# Altium project ADC_Project.PrjPcb
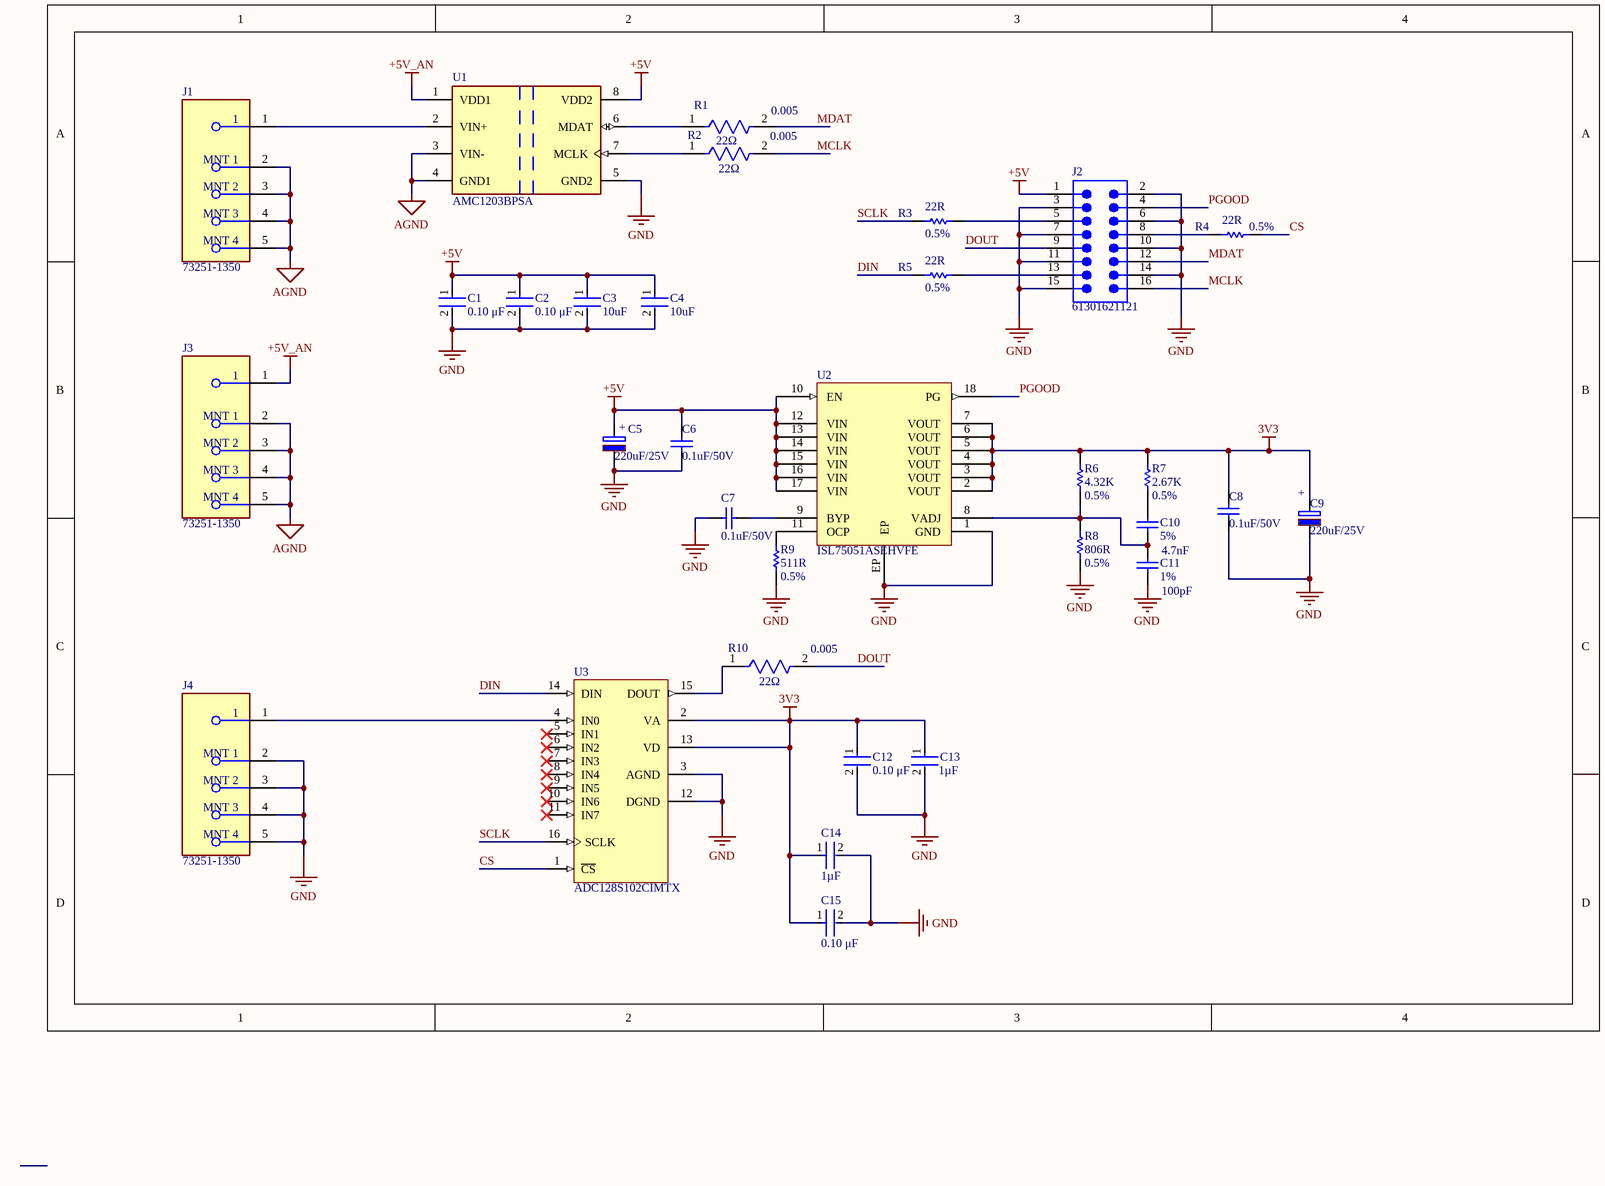
[diagram p0: 1_Schematic.SchDoc]
1 sheet, 32 parts. Net scope: global (net labels, ports and power ports of the same name join across sheets).
Board file: ADC_PCB.PcbDoc

## Sheet 1_Schematic.SchDoc
size A4; SheetNumber: 1; SheetTotal: 1

### Parts
C1  Capacitance: 0.10 μF  [FP-C0603C-CF-MFG]  (hidden comment: C0603C104J5RACTU)
C2  Capacitance: 0.10 μF  [FP-C0603C-CF-MFG]  (hidden comment: C0603C104J5RACTU)
C3  value 10uF  [FP-GRM188-0_2-IPC_A]  (hidden comment: GRM188R61E106KA73D)
C4  value 10uF  [FP-GRM188-0_2-IPC_A]  (hidden comment: GRM188R61E106KA73D)
C5  220uF/25V  [CAP_AE830X1050N]
C6  0.1uF/50V  [CAPC1608X90N]
C7  0.1uF/50V  [CAPC1608X90N]
C8  0.1uF/50V  [CAPC1608X90N]
C9  220uF/25V  [CAP_AE830X1050N]
C10  4.7nF  Tolerance: 5%  [CAPC1608X90N]
C11  100pF  Tolerance: 1%  [CAPC1608X90N]
C12  Capacitance: 0.10 μF  [FP-C0603C-CF-MFG]  (hidden comment: C0603C104J5RACTU)
C13  Capacitance: 1µF  [FP-GCM188-0_1-MFG]  (hidden comment: GCM188R71E105KA64D)
C14  Capacitance: 1µF  [FP-GCM188-0_1-MFG]  (hidden comment: GCM188R71E105KA64D)
C15  Capacitance: 0.10 μF  [FP-C0603C-CF-MFG]  (hidden comment: C0603C104J5RACTU)
J1  73251-1350  [FP-73251-1350-MFG]
J2  61301621121  [61301621121]
J3  73251-1350  [FP-73251-1350-MFG]
J4  73251-1350  [FP-73251-1350-MFG]
R1  value 22Ω  Tolerance: 0.005  [FP-RT0603-MFG]  (hidden comment: RT0603DRD0722RL)
R2  value 22Ω  Tolerance: 0.005  [FP-RT0603-MFG]  (hidden comment: RT0603DRD0722RL)
R3  22R  Tolerance: 0.5%  [RESC1608X55N]
R4  22R  Tolerance: 0.5%  [RESC1608X55N]
R5  22R  Tolerance: 0.5%  [RESC1608X55N]
R6  4.32K  Tolerance: 0.5%  [RESC1608X55N]
R7  2.67K  Tolerance: 0.5%  [RESC1608X55N]
R8  806R  Tolerance: 0.5%  [RESC1608X55N]
R9  511R  Tolerance: 0.5%  [RESC1608X55N]
R10  value 22Ω  Tolerance: 0.005  [FP-RT0603-MFG]  (hidden comment: RT0603DRD0722RL)
U1  AMC1203BPSA  [FP-PSA0008A-IPC_C]
U2  ISL75051ASEHVFE  [CFP102P1520X310-18AN]
U3  ADC128S102CIMTX  [MTC16_N]

### Nets
3V3: C8.1 C9.1 C12.1 C13.1 C14.1 C15.1 R6.2 R7.2 U2.2(VOUT) U2.3(VOUT) U2.4(VOUT) U2.5(VOUT) U2.6(VOUT) U2.7(VOUT) U3.2(VA) U3.13(VD)
+5V: C1.1 C2.1 C3.1 C4.1 C5.1 C6.1 J2.1 U1.8(VDD2) U2.10(EN) U2.12(VIN) U2.13(VIN) U2.14(VIN) U2.15(VIN) U2.16(VIN) U2.17(VIN)
+5V_AN: J3.1 U1.1(VDD1)
AGND: J1.2(MNT_1) J1.3(MNT_2) J1.4(MNT_3) J1.5(MNT_4) J3.2(MNT_1) J3.3(MNT_2) J3.4(MNT_3) J3.5(MNT_4) U1.3(VIN-) U1.4(GND1)
GND: C1.2 C2.2 C3.2 C4.2 C5.2 C6.2 C7.2 C8.2 C9.2 C11.2 C12.2 C13.2 C14.2 C15.2 J2.2 J2.3 J2.6 J2.7 J2.10 J2.11 J2.14 J2.15 J4.2(MNT_1) J4.3(MNT_2) J4.4(MNT_3) J4.5(MNT_4) R8.1 R9.1 U1.5(GND2) U2.1(GND) U2.EP U3.3(AGND) U3.12(DGND)
CS: R4.2 U3.1(~{CS})
DIN: R5.1 U3.14(DIN)
DOUT: J2.9 R10.2
MCLK: J2.16 R2.2
MDAT: J2.12 R1.2
PGOOD: J2.4 U2.18(PG)
SCLK: R3.1 U3.16(SCLK)
NetC7_1: C7.1 U2.9(BYP)
NetC10_1: C10.1 R7.1
NetC10_2: C10.2 C11.1 R6.1 R8.2 U2.8(VADJ)
NetJ1_1: J1.1 U1.2(VIN+)
NetJ2_5: J2.5 R3.2
NetJ2_8: J2.8 R4.1
NetJ2_13: J2.13 R5.2
NetJ4_1: J4.1 U3.4(IN0)
NetR1_1: R1.1 U1.6(MDAT)
NetR2_1: R2.1 U1.7(MCLK)
NetR9_2: R9.2 U2.11(OCP)
NetR10_1: R10.1 U3.15(DOUT)

Not connected (* = marked no-connect by the designer): U3 5(IN1)* 6(IN2)* 7(IN3)* 8(IN4)* 9(IN5)* 10(IN6)* 11(IN7)*

### Notes on the sheet
- (in symbol CAP ALUM 220UF 20% 25V SMD) +

### Library data of the parts
C1 C2 C12 C15 = CMP-2006-03056-2: CAP CER 0.1UF 50V 5% X7R 0603; Manufacturer: KEMET; Automotive Grade: Grade 1; Tolerance: 0.05; Value: 0.10 μF; Material: Ceramic; Temperature Coefficient: 30ppm/°C; ComponentLink2Description: Datasheet; Voltage Rating: 50 V; Digikey Description: CAP CER 0.1UF 50V 5% X7R 0603; Manufacturer Part Number: C0603C104J5RACTU; Temperature Range High: +125°C; Device Class L2: Capacitors; Octopart: https://octopart.com/c0603c104j5ractu-kemet-10440638; RoHS: TRUE; Mouser Description: Multilayer Ceramic Capacitors MLCC - SMD/SMT 50volts 0.1uF X7R 5%; Temperature Range Low: -55°C; Automotive: Yes; Lead Free: Yes; ComponentLink2URL: https://api.kemet.com/component-edge/download/datasheet/C0603C100J5GACAUTO.pdf; Device Class L3: Ceramic Capacitors; Package: C0603C-CF; Category: Cap; Temperature: -55°C to +125°C; Height: 0.87mm; Temperature Characteristic: X7R; Device Class L1: Passive Components
C3 C4 = CMP-06035-045268-1: Chip Multilayer Ceramic Capacitors for General Purpose, 0603, 10uF, X5R, 15%, 10%, 25V; Case/Package: 0603
C5 C9 = CAP ALUM 220UF 20% 25V SMD: Manufacturer Part Number: EMZA250ADA221MHA0G; Manufacturer: United Chemi-Con; value: 220uF/25V; Height: 10.5mm; ComponentLink1Description: New link; ComponentLink1URL: *; Tolerance: ±20%; Supplier Part Number 1: 565-2550-1-ND
  C5: Supplier 1: DigiKey; Supplier 2: Mouser; Supplier Part Number 2: 667-EEE-FK1E221P
  C9: Supplier 1: Digi-Key
C6-C8 = CAP CER 0.1UF 50V X7R 0603: Manufacturer Part Number: CL10B104KB8NNNC; Manufacturer: Samsung Electro-Mechanics; Tolerance: ±10%; Supplier Part Number 1: 1276-1000-1-ND; Package: 0603; value: 0.1uF/50V; Supplier 1: Digi-Key; Height: 0.9mm; ComponentLink1Description: New link; ComponentLink1URL: *; Voltage - Rated: 50V
C10 = CAP CER 4700PF 50V C0G 0603: Manufacturer Part Number: CGA3E2C0G1H472J080AA; Manufacturer: TDK Corporation; Supplier Part Number 1: 445-6912-1-ND; Package: 0603; value: 4.7nF; Supplier 1: Digi-Key; Height: 0.9mm; ComponentLink1Description: New link; ComponentLink1URL: *; Voltage - Rated: 50V
C11 = CAP CER 100PF 50V C0G/NP0 0603: Manufacturer Part Number: 06035A101FAT2A; Manufacturer: KYOCERA AVX; Supplier Part Number 1: 478-6202-1-ND; Package: 0603; value: 100pF; Supplier 1: Digi-Key; Height: 0.9mm; ComponentLink1Description: New link; ComponentLink1URL: *; Voltage - Rated: 50V
C13 C14 = CMP-2006-02363-4: Manufacturer Lifecycle Status: IN PRODUCTION; NexarPartId: 18909256; Dielectric: X7R; Material: Ceramic; Tolerance: 10%; Voltage Rating: 25V; Thickness: 889µm; Max Operating Temperature: 125°C; Radiation Hardening: No; Weight: 6.293594mg; Lead Free: Lead Free; Mount: Surface Mount; Case Code (Imperial): 0603; REACH SVHC: No SVHC; Lifecycle Status: Production; Depth: 800µm; Min Operating Temperature: -55°C; Height: 800µm; Case Code (Metric): 1608; Case/Package: 0603; Voltage: 25V; Packaging: Cut Tape; Length: 1.6mm; Termination: SMD/SMT; Width: 787.4µm; Voltage Rating (DC): 25V; RoHS: Compliant; Schedule B: 8532240020, 8532240020; Ratings: AEC-Q200
J1 J3 J4 = CMP-04764-000006-1: CONN SMA JACK STR 50 OHM SMD; Manufacturer: Molex; Is Female: yes; Standoff Height: 0.41mm; Impedance: 50Ω; Number Of Contacts: 1; Conn Orientation: Straight; Voltage Rating: 500V; Shielding: true; Frequency: 18GHz; Package: 73251-1350; Device Class L1: Connectors; Category: Conn; Manufacturer Part Number: 73251-1350; ComponentLink2URL: https://www.molex.com/pdm_docs/sd/732511350_sd.pdf; Automotive: No; Height: 9.655mm; Octopart: https://octopart.com/73251-1350-molex-5414390; Footprint Url: https://forum.upverter.com/uploads/default/original/3X/d/a/daeafa2ce4908d4fc4e49f0b17d7d2c986fce444.pdf; Temperature Range High: +165°C; Device Class L3: unset; Mouser Description: RF Connectors / Coaxial Connectors SMA ST PCB-JCK STD SMT; Lead Free: Yes; Temperature: -65°C to +165°C; RoHS: TRUE; ComponentLink2Description: Datasheet; Device Class L2: RF / Coaxial Connectors; Digikey Description: CONN SMA JACK STR 50 OHM SMD; Contact Material: Gold; Temperature Range Low: -65°C
J2 = CMP-1502-01097-2: NexarPartId: 32855550; Gender: Male; Pitch: 2.54mm; Contact Resistance: 20mΩ; Connector Type: Male Pin; Voltage Rating: 250V; Number of Contacts: 16; Current Rating: 3A; Orientation: Vertical; Packaging: Bulk; Contact Plating: Gold; Max Operating Temperature: 105°C; Contact Mating Length: 5.9944mm; Termination: Solder; Row Spacing: 2.54mm; REACH SVHC: Unknown; Height: 8.89mm; RoHS: Compliant; Number of Pins: 16; Number of Rows: 2; Mount: Through Hole; Contact Material: Copper; Number of Positions: 16; Min Operating Temperature: -40°C; Operating Supply Voltage: 250V; Lead Pitch: 2.54mm; Color: Black
R1 R2 R10 = CMP-03412-013306-1: RES SMD 22 OHM 0.5% 1/10W 0603; Manufacturer: Yageo; Temperature Coefficient: 25 ppm/°C; Power Rating: 0.1W; Voltage Rating: 75V; Temperature: -55°C to +155°C; ComponentLink2URL: http://www.yageo.com/documents/recent/PYu-RT_1-to-0.01_RoHS_L_9.pdf; ComponentLink2Description: Datasheet; Package: RT0603; Automotive: No; Manufacturer Part Number: RT0603DRD0722RL; Category: Res; Temperature Range High: +155°C; Device Class L3: Chip SMD Resistors; Footprint Url: http://www.yageo.com/exep/pages/download/literatures/PYu-R_Mount_10.pdf; Device Class L1: Passive Components; Series: RT; Lead Free: Yes; Digikey Description: RES SMD 22 OHM 0.5% 1/10W 0603; Composition: Thin Film; Resistance: 22Ω; Ipc Land Pattern Name: RESC16080X45; Height: 0.55mm; Device Class L2: Resistors; RoHS: TRUE; Octopart: https://octopart.com/rt0603drd0722rl-yageo-1189544; Temperature Range Low: -55°C
R3-R5 = RES SMD 22 OHM 0.5% 1/10W 0603: Manufacturer: Yageo; Manufacturer Part Number: RT0603DRD0722RL; Supplier Part Number 1: 13-RT0603DRD0722RLCT-ND; Package: 0603; Height: 0.55mm; Supplier 1: Digi-Key; value: 22R
R6 = RES SMD 4.32K OHM 0.5% 1/5W 0603: Manufacturer: Panasonic Electronic Components; Manufacturer Part Number: ERJ-PB3D4321V; Supplier Part Number 1: P20355CT-ND; Package: 0603; Height: 0.55mm; Supplier 1: Digi-Key; value: 4.32K
R7 = RES SMD 2.67KOHM 0.5% 1/10W 0603: Manufacturer: Yageo; Manufacturer Part Number: RT0603DRD072K67L; Supplier Part Number 1: 311-2.67KDCT-ND; Package: 0603; Height: 0.55mm; Supplier 1: Digi-Key; value: 2.67K
R8 = RES SMD 806 OHM 0.5% 1/10W 0603: Manufacturer: Yageo; Manufacturer Part Number: RT0603DRD0762KL; Supplier Part Number 1: 311-806DCT-ND; Package: 0603; Height: 0.55mm; Supplier 1: Digi-Key; value: 806R
R9 = RES SMD 511 OHM 1% 1/10W 0603: Manufacturer: Panasonic Electronic Components; Manufacturer Part Number: ERJ-3EKF5110V; Supplier Part Number 1: P511HCT-ND; Package: 0603; Height: 0.55mm; Supplier 1: Digi-Key; value: 511R
U1 = CMP-04860-000036-1: IC ADC 16BIT SIGMA-DELTA 8SOP; Input Type: DIFFERENTIAL; Min Supply Voltage: 4.5V; Max Power Dissipation: 110mW; Supply Type: Analog; Operating Supply Voltage: 5V; Number of Channels: 1; Number of Bits: 16; Power Consumption: 80mW; Interface: Serial; Differential Nonlinearity: 1LSB; Signal to Noise Ratio (SNR): 85dB; Resolution: 16b; Max Supply Voltage: 5.5V; Integral Nonlinearity (INL): 6LSB; Polarity: Bipolar; Sampling Rate: 40KS/s; Lead Free: Lead Free; Case/Package: SOP; Number of Pins: 8; Packaging: Rail/Tube; Mount: Surface Mount; Package Quantity: 95; RoHS Compliant: Yes; Number of Converters: 1; Min Operating Temperature: -40°C; Number of Analog Inputs: 1; Max Operating Temperature: 105°C; Number of Elements: 1; Contact Plating: Gold; Power Dissipation: 80mW; Number of A/D Converters: 1; Number of Inputs: 1
U2 = CMP-040-000002-1: Voltage regulator, linear, variable, 3 A, CFP-18 exposed pad, class V; Manufacturer: Renesas / Intersil; EM Part Number: ISL75051ASEHFE/PROTO; FM (SMD) Part Number: 5962R1121203VYC; Available Preview Images: 2D; TID: 50krad (LDR), 100krad (HDR); Input Voltage Low: 2.2V; Output Current Max: 3A; Lead Form: Yes; Mass: 1.07g; Output Voltage: 0.8 - 5.0V; SEL: 86.3MeV*cm2/mg; Input Voltage High: 6V; ComponentLink1Description: Datasheet - Manufacturer; ComponentLink2URL: https://landandmaritimeapps.dla.mil/downloads/milspec/smd/11212.pdf; Design Item ID: ISL75051ASEHVFE; Mount Type: SMT; ComponentLink2Description: Datasheet - Mil Spec; Manufacturer Part Number: ISL75051ASEHVFE; Device Class: V; Package: CFP-18 (exposed pad); Distributor: Avnet; ComponentLink1URL: https://www.renesas.com/us/en/www/doc/datasheet/isl75051aseh-3051aseh.pdf; Source: IsolatedADCs.SCHLIB
U3 = CMP-0054-00337-2: 8-Channel, 500 kSPS to 1 MSPS, 12-Bit A/D Converter, 16-pin TSSOP; Manufacturer: National Semiconductor; PackageTopMarking: NSUZXYTT*128S102*CIMT; CompType: ADC IC; PowerWise: Y; Code_JEDEC: MO-153-AB; DatasheetVersion: Jul-2009; PackageReference: MTC16; ComponentLink3URL: http://www.national.com/packaging/folders/mtc16.html; PinCount: 16; ComponentLink1URL: http://www.national.com/ds/AD/ADC128S102.pdf; PackageVersion: revD, Jun-2003; RevisionNote: Component URLs added; ComponentLink2URL: http://www.national.com/pf/AD/ADC128S102.html; PackageDescription: Molded TSSOP, Jedec, 5 x 4.4 x 0.9mm Body, 16 Lead, 0.65mm Pitch; ComponentLink1Description: ADC128S102 Datasheet; ComponentLink3Description: MTC16 Package Page; RoHS: N; ComponentLink2Description: ADC128S102 Web Page